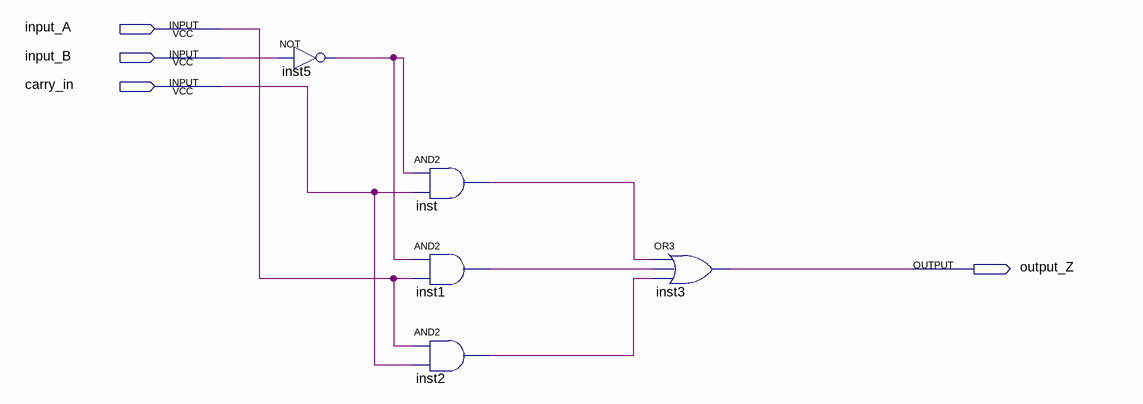
[diagram p0: schematic sheet]
// Quartus schematic menor_sinal.bdf as structural Verilog: 5 symbols, 4 pins
module menor_sinal (
  input  input_A,
  input  input_B,
  input  carry_in,
  output output_Z
);

  wire inst1_out, inst2_out, inst5_out, inst_out;

  not inst5 (inst5_out, input_B);
  and inst (inst_out, inst5_out, carry_in);
  and inst1 (inst1_out, inst5_out, input_A);
  and inst2 (inst2_out, input_A, carry_in);
  or inst3 (output_Z, inst_out, inst1_out, inst2_out);
endmodule
